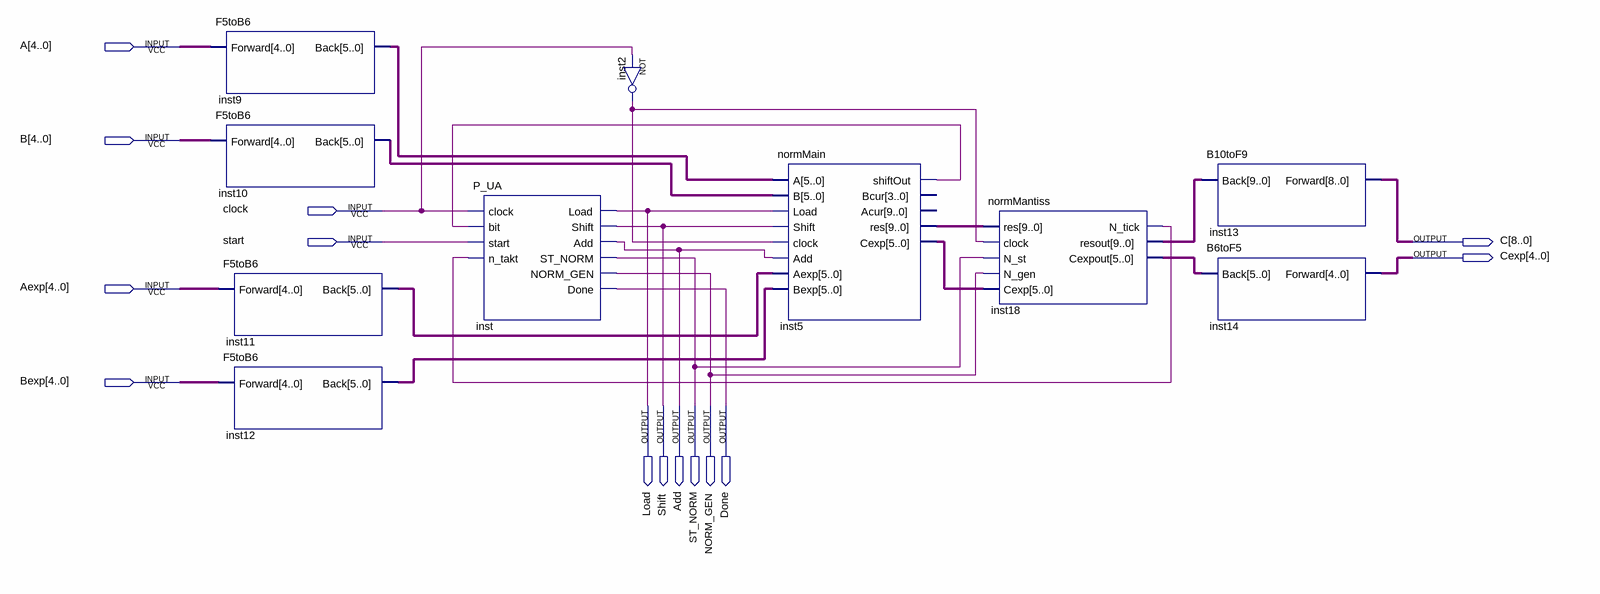
[diagram p0: schematic sheet]
// Quartus schematic full.bdf as structural Verilog: 10 symbols, 14 pins
module full (
  input  [4:0] A,
  input  [4:0] B,
  input  clock,
  input  start,
  input  [4:0] Aexp,
  input  [4:0] Bexp,
  output [8:0] C,
  output [4:0] Cexp,
  output Load,
  output Shift,
  output Add,
  output ST_NORM,
  output NORM_GEN,
  output Done
);

  wire inst2_out, inst5_shiftout, inst18_n_tick;
  wire [5:0] inst5_cexp, inst9_back, inst10_back, inst11_back, inst12_back, inst18_cexpout;
  wire [9:0] inst5_res, inst18_resout;

  F5toB6 inst9 (.Forward(A), .Back(inst9_back));
  F5toB6 inst10 (.Forward(B), .Back(inst10_back));
  F5toB6 inst11 (.Forward(Aexp), .Back(inst11_back));
  F5toB6 inst12 (.Forward(Bexp), .Back(inst12_back));
  P_UA inst (
    .clock(clock), .\bit (inst5_shiftout), .start(start), .n_takt(inst18_n_tick), .Load(Load), .Shift(Shift),
    .Add(Add), .ST_NORM(ST_NORM), .NORM_GEN(NORM_GEN), .Done(Done));
  not inst2 (inst2_out, clock);
  normMain inst5 (
    .A(inst9_back), .B(inst10_back), .Load(Load), .Shift(Shift), .clock(inst2_out), .Add(Add),
    .Aexp(inst11_back), .Bexp(inst12_back), .shiftOut(inst5_shiftout), .res(inst5_res), .Cexp(inst5_cexp));  // open: Bcur, Acur
  normMantiss inst18 (
    .res(inst5_res), .clock(inst2_out), .N_st(ST_NORM), .N_gen(NORM_GEN), .Cexp(inst5_cexp),
    .N_tick(inst18_n_tick), .resout(inst18_resout), .Cexpout(inst18_cexpout));
  B10toF9 inst13 (.Back(inst18_resout), .Forward(C));
  B6toF5 inst14 (.Back(inst18_cexpout), .Forward(Cexp));
endmodule
